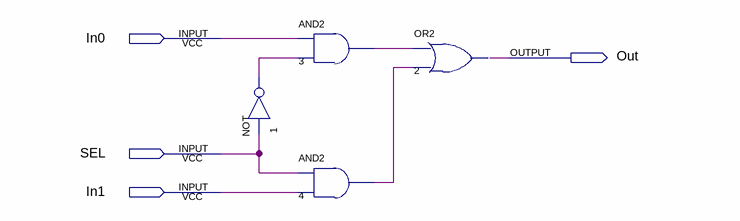
[diagram p0: schematic sheet]
// Quartus schematic slctr.bdf as structural Verilog: 4 symbols, 4 pins
module slctr (
  input  In0,
  input  SEL,
  input  In1,
  output Out
);

  wire n1_out, n3_out, n4_out;

  and u_3 (n3_out, In0, n1_out);
  not u_1 (n1_out, SEL);
  and u_4 (n4_out, SEL, In1);
  or u_2 (Out, n3_out, n4_out);
endmodule
